# Altium schematic sheet IO_Expander.SchDoc: I/O Expander
size A3; Author: M.Beldyga; CompanyName: WUT ISE; DrawnBy: M.Beldyga; Organization: WUT ISE; Address1: PW ISE; Address2: Nowowiejska 15/19 00-665 Warsaw; Address3: micbeldyga@gmail.com; SheetNumber: 6; SheetTotal: 12; ModifiedBy: -; CheckedDate: -; DivGrp: WUT ISE; Designer: M.Beldyga; ModifiedDate: -; ProjectName: Sensor Box
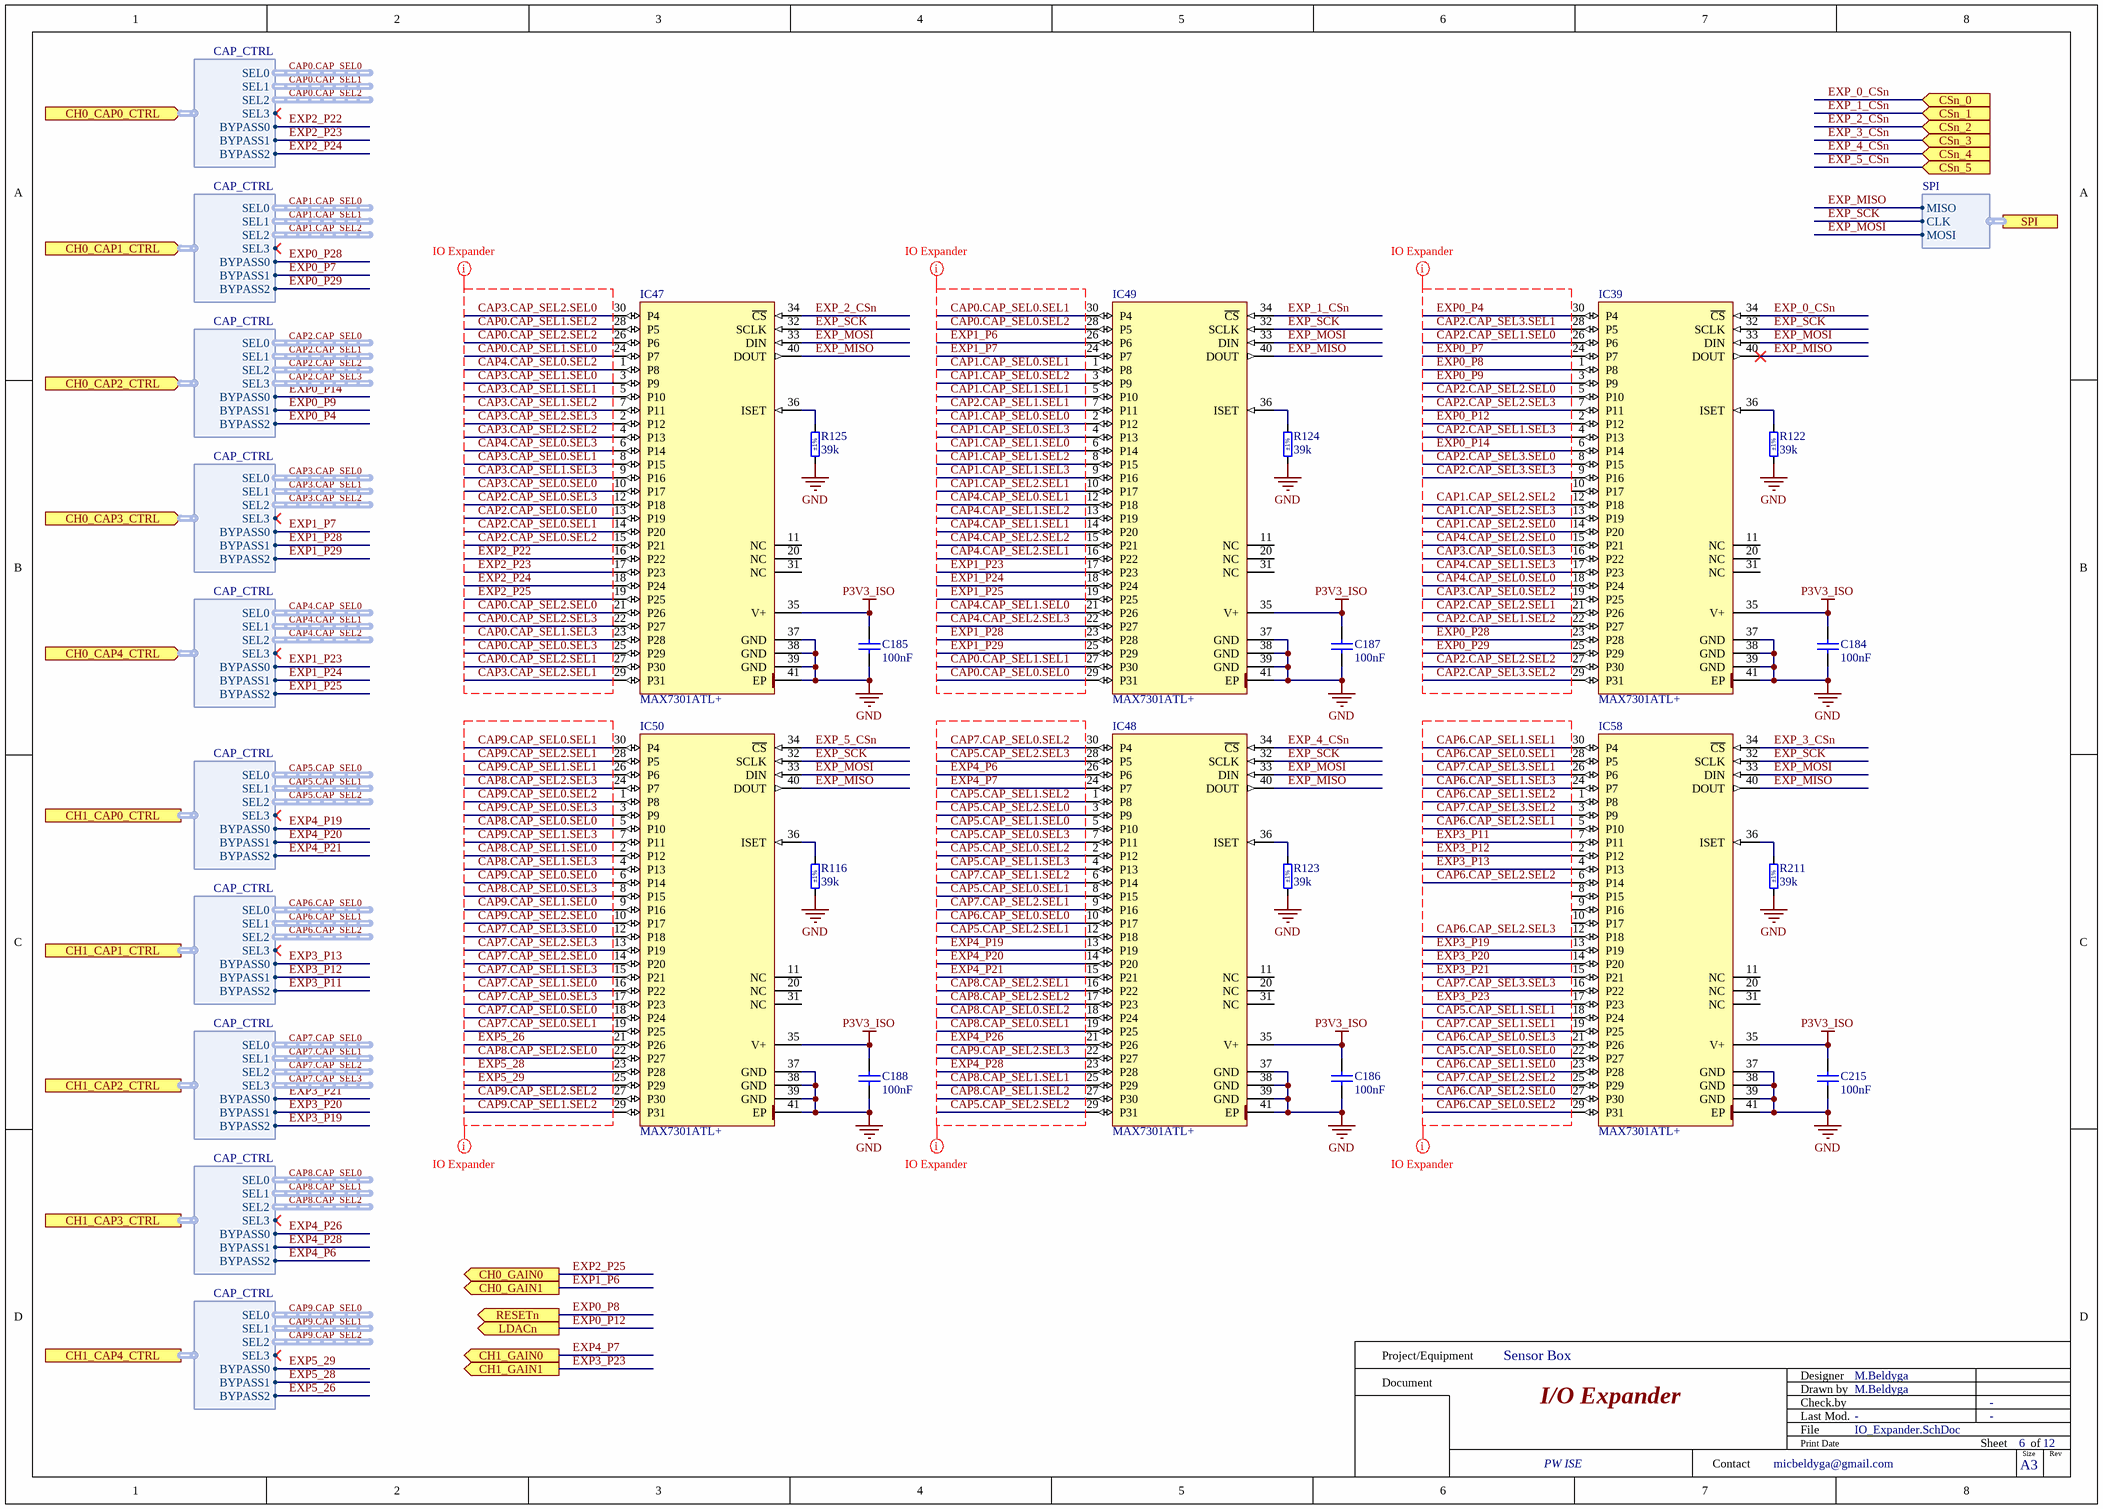
[diagram p0: IO_Expander.SchDoc]

## Parts
C184  100nF  [CAPC1005X55N]
C185  100nF  [CAPC1005X55N]
C186  100nF  [CAPC1005X55N]
C187  100nF  [CAPC1005X55N]
C188  100nF  [CAPC1005X55N]
C215  100nF  [CAPC1005X55N]
IC39  MAX7301ATL+  [QFN50P600X600X80-41N-S425]
IC47  MAX7301ATL+  [QFN50P600X600X80-41N-S425]
IC48  MAX7301ATL+  [QFN50P600X600X80-41N-S425]
IC49  MAX7301ATL+  [QFN50P600X600X80-41N-S425]
IC50  MAX7301ATL+  [QFN50P600X600X80-41N-S425]
IC58  MAX7301ATL+  [QFN50P600X600X80-41N-S425]
R116  39k  Tolerance: ±1%  [RESC1005X40N]
R122  39k  Tolerance: ±1%  [RESC1005X40N]
R123  39k  Tolerance: ±1%  [RESC1005X40N]
R124  39k  Tolerance: ±1%  [RESC1005X40N]
R125  39k  Tolerance: ±1%  [RESC1005X40N]
R211  39k  Tolerance: ±1%  [RESC1005X40N]

## Ports
CH0_CAP0_CTRL (in, harness CAP_CTRL), CH0_CAP1_CTRL (in, harness CAP_CTRL), CH0_CAP2_CTRL (in, harness CAP_CTRL), CH0_CAP3_CTRL (in, harness CAP_CTRL), CH0_CAP4_CTRL (in, harness CAP_CTRL), CH0_GAIN0 (out), CH0_GAIN1 (out), CH1_CAP0_CTRL (harness CAP_CTRL), CH1_CAP1_CTRL (harness CAP_CTRL), CH1_CAP2_CTRL (harness CAP_CTRL), CH1_CAP3_CTRL (harness CAP_CTRL), CH1_CAP4_CTRL (harness CAP_CTRL), CH1_GAIN0 (out), CH1_GAIN1 (out), CSn_0 (in), CSn_1 (in), CSn_2 (in), CSn_3 (in), CSn_4 (in), CSn_5 (in), LDACn (out), RESETn (out), SPI (harness SPI)

## Harnesses
SPI: CLK, MOSI, MISO
CAP_CTRL: BYPASS0, BYPASS1, SEL0, SEL1, SEL2, SEL3, BYPASS2

## Nets
GND: C184.1 C185.1 C186.1 C187.1 C188.1 C215.1 IC39.37(GND) IC39.38(GND) IC39.39(GND) IC39.41(EP) IC47.37(GND) IC47.38(GND) IC47.39(GND) IC47.41(EP) IC48.37(GND) IC48.38(GND) IC48.39(GND) IC48.41(EP) IC49.37(GND) IC49.38(GND) IC49.39(GND) IC49.41(EP) IC50.37(GND) IC50.38(GND) IC50.39(GND) IC50.41(EP) IC58.37(GND) IC58.38(GND) IC58.39(GND) IC58.41(EP) R116.1 R122.1 R123.1 R124.1 R125.1 R211.1
P3V3_ISO: C184.2 C185.2 C186.2 C187.2 C188.2 C215.2 IC39.35(V+) IC47.35(V+) IC48.35(V+) IC49.35(V+) IC50.35(V+) IC58.35(V+)
CAP0.CAP_SEL0.SEL0: IC49.29(P31)
CAP0.CAP_SEL0.SEL1: IC49.30(P4)
CAP0.CAP_SEL0.SEL2: IC49.28(P5)
CAP0.CAP_SEL0.SEL3: IC47.25(P29)
CAP0.CAP_SEL1.SEL0: IC47.24(P7)
CAP0.CAP_SEL1.SEL1: IC49.27(P30)
CAP0.CAP_SEL1.SEL2: IC47.28(P5)
CAP0.CAP_SEL1.SEL3: IC47.23(P28)
CAP0.CAP_SEL2.SEL0: IC47.21(P26)
CAP0.CAP_SEL2.SEL1: IC47.27(P30)
CAP0.CAP_SEL2.SEL2: IC47.26(P6)
CAP0.CAP_SEL2.SEL3: IC47.22(P27)
CAP1.CAP_SEL0.SEL0: IC49.2(P12)
CAP1.CAP_SEL0.SEL1: IC49.1(P8)
CAP1.CAP_SEL0.SEL2: IC49.3(P9)
CAP1.CAP_SEL0.SEL3: IC49.4(P13)
CAP1.CAP_SEL1.SEL0: IC49.6(P14)
CAP1.CAP_SEL1.SEL1: IC49.5(P10)
CAP1.CAP_SEL1.SEL2: IC49.8(P15)
CAP1.CAP_SEL1.SEL3: IC49.9(P16)
CAP1.CAP_SEL2.SEL0: IC39.14(P20)
CAP1.CAP_SEL2.SEL1: IC49.10(P17)
CAP1.CAP_SEL2.SEL2: IC39.12(P18)
CAP1.CAP_SEL2.SEL3: IC39.13(P19)
CAP2.CAP_SEL0.SEL0: IC47.13(P19)
CAP2.CAP_SEL0.SEL1: IC47.14(P20)
CAP2.CAP_SEL0.SEL2: IC47.15(P21)
CAP2.CAP_SEL0.SEL3: IC47.12(P18)
CAP2.CAP_SEL1.SEL0: IC39.26(P6)
CAP2.CAP_SEL1.SEL1: IC49.7(P11)
CAP2.CAP_SEL1.SEL2: IC39.22(P27)
CAP2.CAP_SEL1.SEL3: IC39.4(P13)
CAP2.CAP_SEL2.SEL0: IC39.5(P10)
CAP2.CAP_SEL2.SEL1: IC39.21(P26)
CAP2.CAP_SEL2.SEL2: IC39.27(P30)
CAP2.CAP_SEL2.SEL3: IC39.7(P11)
CAP2.CAP_SEL3.SEL0: IC39.8(P15)
CAP2.CAP_SEL3.SEL1: IC39.28(P5)
CAP2.CAP_SEL3.SEL2: IC39.29(P31)
CAP2.CAP_SEL3.SEL3: IC39.9(P16)
CAP3.CAP_SEL0.SEL0: IC47.10(P17)
CAP3.CAP_SEL0.SEL1: IC47.8(P15)
CAP3.CAP_SEL0.SEL2: IC39.19(P25)
CAP3.CAP_SEL0.SEL3: IC39.16(P22)
CAP3.CAP_SEL1.SEL0: IC47.3(P9)
CAP3.CAP_SEL1.SEL1: IC47.5(P10)
CAP3.CAP_SEL1.SEL2: IC47.7(P11)
CAP3.CAP_SEL1.SEL3: IC47.9(P16)
CAP3.CAP_SEL2.SEL0: IC47.30(P4)
CAP3.CAP_SEL2.SEL1: IC47.29(P31)
CAP3.CAP_SEL2.SEL2: IC47.4(P13)
CAP3.CAP_SEL2.SEL3: IC47.2(P12)
CAP4.CAP_SEL0.SEL0: IC39.18(P24)
CAP4.CAP_SEL0.SEL1: IC49.12(P18)
CAP4.CAP_SEL0.SEL2: IC47.1(P8)
CAP4.CAP_SEL0.SEL3: IC47.6(P14)
CAP4.CAP_SEL1.SEL0: IC49.21(P26)
CAP4.CAP_SEL1.SEL1: IC49.14(P20)
CAP4.CAP_SEL1.SEL2: IC49.13(P19)
CAP4.CAP_SEL1.SEL3: IC39.17(P23)
CAP4.CAP_SEL2.SEL0: IC39.15(P21)
CAP4.CAP_SEL2.SEL1: IC49.16(P22)
CAP4.CAP_SEL2.SEL2: IC49.15(P21)
CAP4.CAP_SEL2.SEL3: IC49.22(P27)
CAP5.CAP_SEL0.SEL0: IC58.22(P27)
CAP5.CAP_SEL0.SEL1: IC48.8(P15)
CAP5.CAP_SEL0.SEL2: IC48.2(P12)
CAP5.CAP_SEL0.SEL3: IC48.7(P11)
CAP5.CAP_SEL1.SEL0: IC48.5(P10)
CAP5.CAP_SEL1.SEL1: IC58.18(P24)
CAP5.CAP_SEL1.SEL2: IC48.1(P8)
CAP5.CAP_SEL1.SEL3: IC48.4(P13)
CAP5.CAP_SEL2.SEL0: IC48.3(P9)
CAP5.CAP_SEL2.SEL1: IC48.12(P18)
CAP5.CAP_SEL2.SEL2: IC48.29(P31)
CAP5.CAP_SEL2.SEL3: IC48.28(P5)
CAP6.CAP_SEL0.SEL0: IC48.10(P17)
CAP6.CAP_SEL0.SEL1: IC58.28(P5)
CAP6.CAP_SEL0.SEL2: IC58.29(P31)
CAP6.CAP_SEL0.SEL3: IC58.21(P26)
CAP6.CAP_SEL1.SEL0: IC58.23(P28)
CAP6.CAP_SEL1.SEL1: IC58.30(P4)
CAP6.CAP_SEL1.SEL2: IC58.1(P8)
CAP6.CAP_SEL1.SEL3: IC58.24(P7)
CAP6.CAP_SEL2.SEL0: IC58.27(P30)
CAP6.CAP_SEL2.SEL1: IC58.5(P10)
CAP6.CAP_SEL2.SEL2: IC58.6(P14)
CAP6.CAP_SEL2.SEL3: IC58.12(P18)
CAP7.CAP_SEL0.SEL0: IC50.18(P24)
CAP7.CAP_SEL0.SEL1: IC50.19(P25)
CAP7.CAP_SEL0.SEL2: IC48.30(P4)
CAP7.CAP_SEL0.SEL3: IC50.17(P23)
CAP7.CAP_SEL1.SEL0: IC50.16(P22)
CAP7.CAP_SEL1.SEL1: IC58.19(P25)
CAP7.CAP_SEL1.SEL2: IC48.6(P14)
CAP7.CAP_SEL1.SEL3: IC50.15(P21)
CAP7.CAP_SEL2.SEL0: IC50.14(P20)
CAP7.CAP_SEL2.SEL1: IC48.9(P16)
CAP7.CAP_SEL2.SEL2: IC58.25(P29)
CAP7.CAP_SEL2.SEL3: IC50.13(P19)
CAP7.CAP_SEL3.SEL0: IC50.12(P18)
CAP7.CAP_SEL3.SEL1: IC58.26(P6)
CAP7.CAP_SEL3.SEL2: IC58.3(P9)
CAP7.CAP_SEL3.SEL3: IC58.16(P22)
CAP8.CAP_SEL0.SEL0: IC50.5(P10)
CAP8.CAP_SEL0.SEL1: IC48.19(P25)
CAP8.CAP_SEL0.SEL2: IC48.18(P24)
CAP8.CAP_SEL0.SEL3: IC50.8(P15)
CAP8.CAP_SEL1.SEL0: IC50.2(P12)
CAP8.CAP_SEL1.SEL1: IC48.25(P29)
CAP8.CAP_SEL1.SEL2: IC48.27(P30)
CAP8.CAP_SEL1.SEL3: IC50.4(P13)
CAP8.CAP_SEL2.SEL0: IC50.22(P27)
CAP8.CAP_SEL2.SEL1: IC48.16(P22)
CAP8.CAP_SEL2.SEL2: IC48.17(P23)
CAP8.CAP_SEL2.SEL3: IC50.24(P7)
CAP9.CAP_SEL0.SEL0: IC50.6(P14)
CAP9.CAP_SEL0.SEL1: IC50.30(P4)
CAP9.CAP_SEL0.SEL2: IC50.1(P8)
CAP9.CAP_SEL0.SEL3: IC50.3(P9)
CAP9.CAP_SEL1.SEL0: IC50.9(P16)
CAP9.CAP_SEL1.SEL1: IC50.26(P6)
CAP9.CAP_SEL1.SEL2: IC50.29(P31)
CAP9.CAP_SEL1.SEL3: IC50.7(P11)
CAP9.CAP_SEL2.SEL0: IC50.10(P17)
CAP9.CAP_SEL2.SEL1: IC50.28(P5)
CAP9.CAP_SEL2.SEL2: IC50.27(P30)
CAP9.CAP_SEL2.SEL3: IC48.22(P27)
EXP0_P4: IC39.30(P4) ; port CH0_CAP2_CTRL.BYPASS2
EXP0_P7: IC39.24(P7) ; port CH0_CAP1_CTRL.BYPASS1
EXP0_P8: IC39.1(P8) ; port RESETn
EXP0_P9: IC39.3(P9) ; port CH0_CAP2_CTRL.BYPASS1
EXP0_P12: IC39.2(P12) ; port LDACn
EXP0_P14: IC39.6(P14) ; port CH0_CAP2_CTRL.BYPASS0
EXP0_P28: IC39.23(P28) ; port CH0_CAP1_CTRL.BYPASS0
EXP0_P29: IC39.25(P29) ; port CH0_CAP1_CTRL.BYPASS2
EXP1_P6: IC49.26(P6) ; port CH0_GAIN1
EXP1_P7: IC49.24(P7) ; port CH0_CAP3_CTRL.BYPASS0
EXP1_P23: IC49.17(P23) ; port CH0_CAP4_CTRL.BYPASS0
EXP1_P24: IC49.18(P24) ; port CH0_CAP4_CTRL.BYPASS1
EXP1_P25: IC49.19(P25) ; port CH0_CAP4_CTRL.BYPASS2
EXP1_P28: IC49.23(P28) ; port CH0_CAP3_CTRL.BYPASS1
EXP1_P29: IC49.25(P29) ; port CH0_CAP3_CTRL.BYPASS2
EXP2_P22: IC47.16(P22) ; port CH0_CAP0_CTRL.BYPASS0
EXP2_P23: IC47.17(P23) ; port CH0_CAP0_CTRL.BYPASS1
EXP2_P24: IC47.18(P24) ; port CH0_CAP0_CTRL.BYPASS2
EXP2_P25: IC47.19(P25) ; port CH0_GAIN0
EXP3_P11: IC58.7(P11) ; port CH1_CAP1_CTRL.BYPASS2
EXP3_P12: IC58.2(P12) ; port CH1_CAP1_CTRL.BYPASS1
EXP3_P13: IC58.4(P13) ; port CH1_CAP1_CTRL.BYPASS0
EXP3_P19: IC58.13(P19) ; port CH1_CAP2_CTRL.BYPASS2
EXP3_P20: IC58.14(P20) ; port CH1_CAP2_CTRL.BYPASS1
EXP3_P21: IC58.15(P21) ; port CH1_CAP2_CTRL.BYPASS0
EXP3_P23: IC58.17(P23) ; port CH1_GAIN1
EXP4_P6: IC48.26(P6) ; port CH1_CAP3_CTRL.BYPASS2
EXP4_P7: IC48.24(P7) ; port CH1_GAIN0
EXP4_P19: IC48.13(P19) ; port CH1_CAP0_CTRL.BYPASS0
EXP4_P20: IC48.14(P20) ; port CH1_CAP0_CTRL.BYPASS1
EXP4_P21: IC48.15(P21) ; port CH1_CAP0_CTRL.BYPASS2
EXP4_P26: IC48.21(P26) ; port CH1_CAP3_CTRL.BYPASS0
EXP4_P28: IC48.23(P28) ; port CH1_CAP3_CTRL.BYPASS1
EXP5_26: IC50.21(P26) ; port CH1_CAP4_CTRL.BYPASS2
EXP5_28: IC50.23(P28) ; port CH1_CAP4_CTRL.BYPASS1
EXP5_29: IC50.25(P29) ; port CH1_CAP4_CTRL.BYPASS0
EXP_0_CSn: IC39.34(~{CS}) ; port CSn_0
EXP_1_CSn: IC49.34(~{CS}) ; port CSn_1
EXP_2_CSn: IC47.34(~{CS}) ; port CSn_2
EXP_3_CSn: IC58.34(~{CS}) ; port CSn_3
EXP_4_CSn: IC48.34(~{CS}) ; port CSn_4
EXP_5_CSn: IC50.34(~{CS}) ; port CSn_5
EXP_MISO: IC39.40(DOUT) IC47.40(DOUT) IC48.40(DOUT) IC49.40(DOUT) IC50.40(DOUT) IC58.40(DOUT) ; port SPI.MISO
EXP_MOSI: IC39.33(DIN) IC47.33(DIN) IC48.33(DIN) IC49.33(DIN) IC50.33(DIN) IC58.33(DIN) ; port SPI.MOSI
EXP_SCK: IC39.32(SCLK) IC47.32(SCLK) IC48.32(SCLK) IC49.32(SCLK) IC50.32(SCLK) IC58.32(SCLK) ; port SPI.CLK
NetIC39_36: IC39.36(ISET) R122.2
NetIC47_36: IC47.36(ISET) R125.2
NetIC48_36: IC48.36(ISET) R123.2
NetIC49_36: IC49.36(ISET) R124.2
NetIC50_36: IC50.36(ISET) R116.2
NetIC58_36: IC58.36(ISET) R211.2

Not connected (* = marked no-connect by the designer): IC39 10(P17) 11(NC) 20(NC) 31(NC); IC47 11(NC) 20(NC) 31(NC); IC48 11(NC) 20(NC) 31(NC); IC49 11(NC) 20(NC) 31(NC); IC50 11(NC) 20(NC) 31(NC); IC58 8(P15) 9(P16) 10(P17) 11(NC) 20(NC) 31(NC)

## Layout directives
net class IO_Expander; net class CH_A_ctrl: CAP5.CAP_SEL0.SEL0, CAP5.CAP_SEL0.SEL1, CAP5.CAP_SEL0.SEL2, CAP5.CAP_SEL0.SEL3, CAP5.CAP_SEL1.SEL0, CAP5.CAP_SEL1.SEL1, CAP5.CAP_SEL1.SEL2, CAP5.CAP_SEL1.SEL3, CAP5.CAP_SEL2.SEL0, CAP5.CAP_SEL2.SEL1, CAP5.CAP_SEL2.SEL2, CAP5.CAP_SEL2.SEL3, CAP6.CAP_SEL0.SEL0, CAP6.CAP_SEL0.SEL1, CAP6.CAP_SEL0.SEL2, CAP6.CAP_SEL0.SEL3, CAP6.CAP_SEL1.SEL0, CAP6.CAP_SEL1.SEL1, CAP6.CAP_SEL1.SEL2, CAP6.CAP_SEL1.SEL3, CAP6.CAP_SEL2.SEL0, CAP6.CAP_SEL2.SEL1, CAP6.CAP_SEL2.SEL2, CAP6.CAP_SEL2.SEL3, CAP7.CAP_SEL0.SEL0, CAP7.CAP_SEL0.SEL1, CAP7.CAP_SEL0.SEL2, CAP7.CAP_SEL0.SEL3, CAP7.CAP_SEL1.SEL0, CAP7.CAP_SEL1.SEL1, CAP7.CAP_SEL1.SEL2, CAP7.CAP_SEL1.SEL3, CAP7.CAP_SEL2.SEL0, CAP7.CAP_SEL2.SEL1, CAP7.CAP_SEL2.SEL2, CAP7.CAP_SEL2.SEL3, CAP7.CAP_SEL3.SEL0, CAP7.CAP_SEL3.SEL1, CAP7.CAP_SEL3.SEL2, CAP7.CAP_SEL3.SEL3, CAP8.CAP_SEL0.SEL0, CAP8.CAP_SEL0.SEL1, CAP8.CAP_SEL0.SEL2, CAP8.CAP_SEL0.SEL3, CAP8.CAP_SEL1.SEL0, CAP8.CAP_SEL1.SEL1, CAP8.CAP_SEL1.SEL2, CAP8.CAP_SEL1.SEL3, CAP8.CAP_SEL2.SEL0, CAP8.CAP_SEL2.SEL1, CAP8.CAP_SEL2.SEL2, CAP8.CAP_SEL2.SEL3, CAP9.CAP_SEL0.SEL0, CAP9.CAP_SEL0.SEL1, CAP9.CAP_SEL0.SEL2, CAP9.CAP_SEL0.SEL3, CAP9.CAP_SEL1.SEL0, CAP9.CAP_SEL1.SEL1, CAP9.CAP_SEL1.SEL2, CAP9.CAP_SEL1.SEL3, CAP9.CAP_SEL2.SEL0, CAP9.CAP_SEL2.SEL1, CAP9.CAP_SEL2.SEL2, CAP9.CAP_SEL2.SEL3, EXP3_P11, EXP3_P12, EXP3_P13, EXP3_P19, EXP3_P20, EXP3_P21, EXP3_P23, EXP4_P6, EXP4_P7, EXP4_P19, EXP4_P20, EXP4_P21, EXP4_P26, EXP4_P28, EXP5_26, EXP5_28, EXP5_29
net class IO_Expander; net class CH_B_ctrl: CAP0.CAP_SEL0.SEL0, CAP0.CAP_SEL0.SEL1, CAP0.CAP_SEL0.SEL2, CAP0.CAP_SEL0.SEL3, CAP0.CAP_SEL1.SEL0, CAP0.CAP_SEL1.SEL1, CAP0.CAP_SEL1.SEL2, CAP0.CAP_SEL1.SEL3, CAP0.CAP_SEL2.SEL0, CAP0.CAP_SEL2.SEL1, CAP0.CAP_SEL2.SEL2, CAP0.CAP_SEL2.SEL3, CAP1.CAP_SEL0.SEL0, CAP1.CAP_SEL0.SEL1, CAP1.CAP_SEL0.SEL2, CAP1.CAP_SEL0.SEL3, CAP1.CAP_SEL1.SEL0, CAP1.CAP_SEL1.SEL1, CAP1.CAP_SEL1.SEL2, CAP1.CAP_SEL1.SEL3, CAP1.CAP_SEL2.SEL0, CAP1.CAP_SEL2.SEL1, CAP1.CAP_SEL2.SEL2, CAP1.CAP_SEL2.SEL3, CAP2.CAP_SEL0.SEL0, CAP2.CAP_SEL0.SEL1, CAP2.CAP_SEL0.SEL2, CAP2.CAP_SEL0.SEL3, CAP2.CAP_SEL1.SEL0, CAP2.CAP_SEL1.SEL1, CAP2.CAP_SEL1.SEL2, CAP2.CAP_SEL1.SEL3, CAP2.CAP_SEL2.SEL0, CAP2.CAP_SEL2.SEL1, CAP2.CAP_SEL2.SEL2, CAP2.CAP_SEL2.SEL3, CAP2.CAP_SEL3.SEL0, CAP2.CAP_SEL3.SEL1, CAP2.CAP_SEL3.SEL2, CAP2.CAP_SEL3.SEL3, CAP3.CAP_SEL0.SEL0, CAP3.CAP_SEL0.SEL1, CAP3.CAP_SEL0.SEL2, CAP3.CAP_SEL0.SEL3, CAP3.CAP_SEL1.SEL0, CAP3.CAP_SEL1.SEL1, CAP3.CAP_SEL1.SEL2, CAP3.CAP_SEL1.SEL3, CAP3.CAP_SEL2.SEL0, CAP3.CAP_SEL2.SEL1, CAP3.CAP_SEL2.SEL2, CAP3.CAP_SEL2.SEL3, CAP4.CAP_SEL0.SEL0, CAP4.CAP_SEL0.SEL1, CAP4.CAP_SEL0.SEL2, CAP4.CAP_SEL0.SEL3, CAP4.CAP_SEL1.SEL0, CAP4.CAP_SEL1.SEL1, CAP4.CAP_SEL1.SEL2, CAP4.CAP_SEL1.SEL3, CAP4.CAP_SEL2.SEL0, CAP4.CAP_SEL2.SEL1, CAP4.CAP_SEL2.SEL2, CAP4.CAP_SEL2.SEL3, EXP0_P4, EXP0_P7, EXP0_P8, EXP0_P9, EXP0_P12, EXP0_P14, EXP0_P28, EXP0_P29, EXP1_P6, EXP1_P7, EXP1_P23, EXP1_P24, EXP1_P25, EXP1_P28, EXP1_P29, EXP2_P22, EXP2_P23, EXP2_P24, EXP2_P25

## Notes on the sheet
- Project/Equipment
- Document
- Designer
- Drawn by
- Check.by
- Contact
- File
- Last Mod.
- Print Date
- Sheet
- Size
- A3
- of
- Rev

## Library data of the parts
C184-C188 C215 = CC0402_100NF_50V_10%_X7R: Non-polarised capacitor; Part Description: SMD Multilayer Chip Ceramic Capacitor; Manufacturer: GENERIC; Manufacturer1 Part Number: GRM155R71H104KE14D; Voltage: 50V; TC: X7R; Tolerance: ±10%; Part Number: CC0402_100NF_50V_10%_X7R; Component Kind: Standard; Component Type: Standard; Pin Count: 2; Value: 100nF; Status: None; Manufacturer Part Number: CC0402_100NF_50V_10%_X7R; Case: 0402; Mounted: Yes; Socket: No; SMD: Yes; Sense: No; Manufacturer1 Example: MURATA; Manufacturer1 ComponentHeight: 0.55mm; HelpURL: \\cern.ch\dfs\Applications\Altium\Datasheets\CC0402_MURATA_GRM155R71H104KE14D.pdf; Author: CERN DEM MR; CreateDate: 6/30/2017; LatestRevisionDate: 6/30/2017
IC39 IC47-IC50 IC58 = MAX7301ATL+: 4-Wire-Interfaced, 2.5V to 5.5V, 28-Port I/O Expander; Manufacturer: MAXIM; PressFit: No; Bonding: No; Part Number: MAX7301ATL+; Component Kind: Standard; Component Type: Standard; Device: MAX7301ATL+; PackageDescription: QFN, 0.50mm Pitch, Square; 40 Pin, 6.00mm L X 6.00mm W X 0.80mm H body (w/Thermal Tab 4.25 X 4.25mm), IPC Medium Density; Part Description: 4-Wire-Interfaced, 2.5V to 5.5V, 28-Port I/O Expander; Manufacturer Part Number: MAX7301ATL; Pin Count: 41; Case: QFN40; Mounted: Yes; Socket: No; SMD: Yes; Sense: No; ComponentHeight: 0.8mm; Author: CERN DEM BC; HelpURL: \\cern.ch\dfs\Applications\Altium\Datasheets\MAX7301ATL+.pdf; CreateDate: 5/4/2020; LatestRevisionDate: 4/4/2022
R116 R122-R125 R211 = R0402_39K_1%_0.0625W_100PPM: Resistor - 1%; Part Description: General Purpose Thick Film Chip Resistor; Manufacturer: GENERIC; Manufacturer1 Part Number: 232270673903; TC: ±100ppm/°C; PressFit: No; Part Number: R0402_39K_1%_0.0625W_100PPM; Component Kind: Standard; Component Type: Standard; Pin Count: 2; Value: 39k; Status: Not Recommended; Power: 0.0625W; Manufacturer Part Number: R0402_39K_1%_0.0625W_100PPM; Case: 0402; Mounted: Yes; Sense: No; Socket: No; SMD: Yes; Manufacturer1 Example: YAGEO PHYCOMP; Manufacturer1 ComponentHeight: 0.4mm; HelpURL: \\cern.ch\dfs\Applications\Altium\Datasheets\R0402_Phycomp_RC0402.pdf; Author: CERN DEM JLC; CreateDate: 12/3/2007; LatestRevisionDate: 10/17/2012